# Altium schematic sheet Sheet1.SchDoc
size A3; DocumentNumber: 1; SheetNumber: 1; SheetTotal: 1
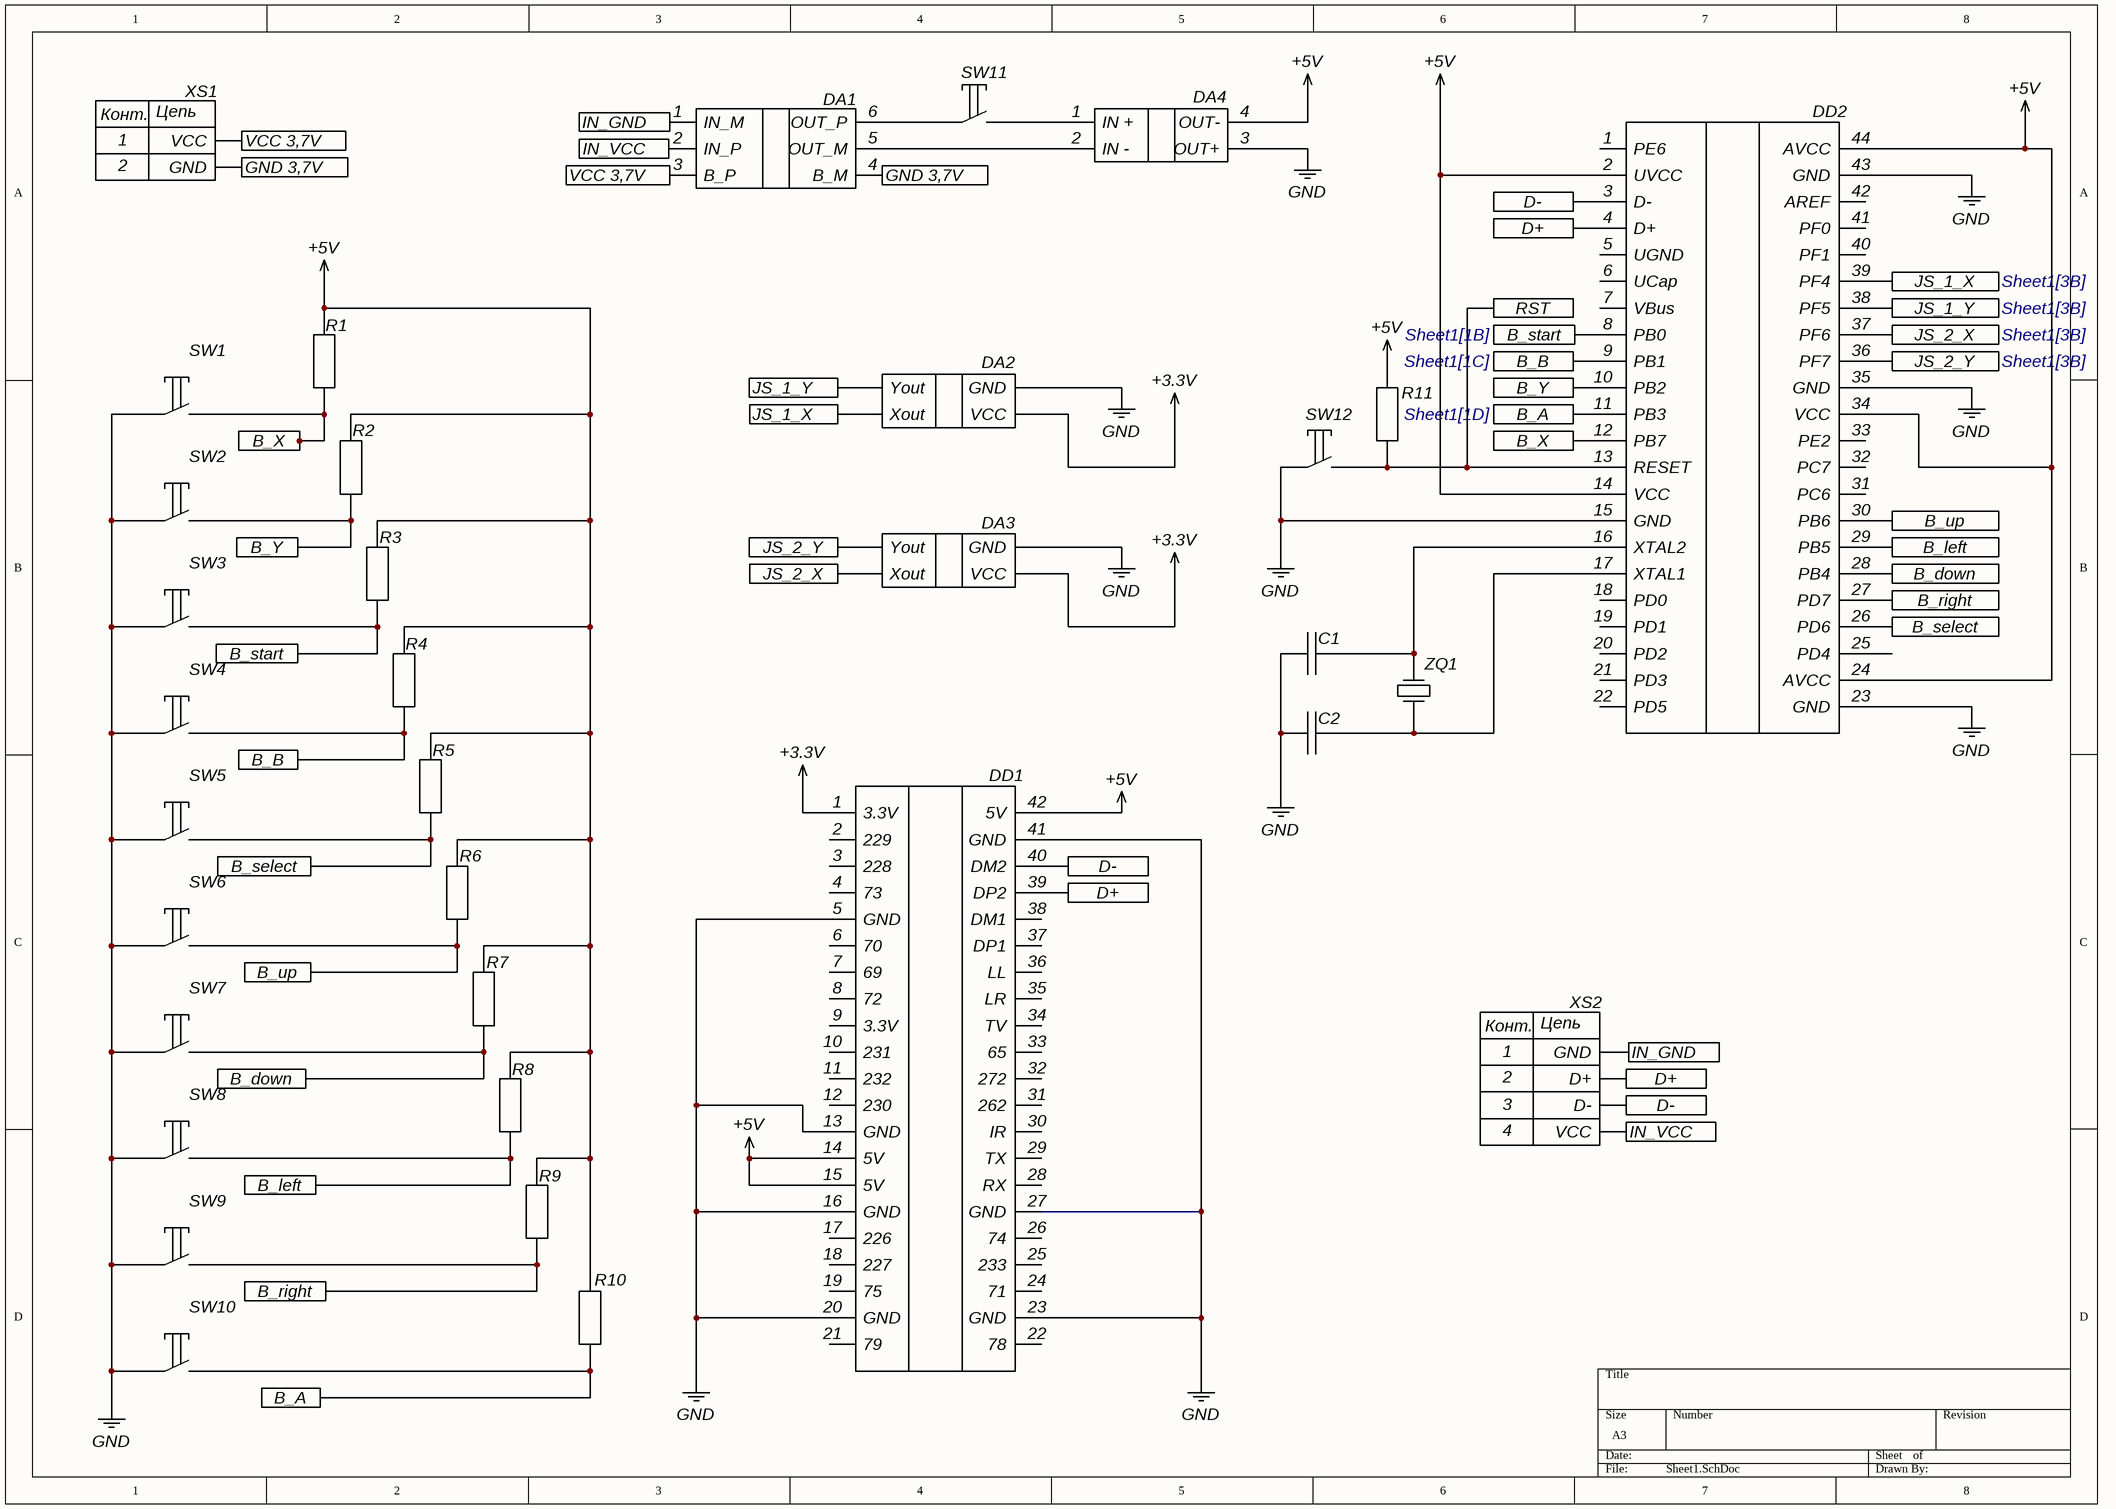
[diagram p0: Sheet1.SchDoc]

## Parts
C1  capasitor  [capacitor 1206]  (value not drawn)
C2  capasitor  [capacitor 1206]  (value not drawn)
DA1  1S 4056 BMS USB C  [1S 4056 BMS USB C]  (value not drawn)
DA2  joy stick 4 pin  [joy stick psp 4 pin]  (value not drawn)
DA3  joy stick 4 pin  [joy stick psp 4 pin]  (value not drawn)
DA4  DC-DC  [DC-DC]  (value not drawn)
DD1  orange PI ZERO 3  [orange Pi Zero 3]  (value not drawn)
DD2  ATmega32U4  [atmega32u4]  (value not drawn)
R1  resistor  [resistor 1206]  (value not drawn)
R2  resistor  [resistor 1206]  (value not drawn)
R3  resistor  [resistor 1206]  (value not drawn)
R4  resistor  [resistor 1206]  (value not drawn)
R5  resistor  [resistor 1206]  (value not drawn)
R6  resistor  [resistor 1206]  (value not drawn)
R7  resistor  [resistor 1206]  (value not drawn)
R8  resistor  [resistor 1206]  (value not drawn)
R9  resistor  [resistor 1206]  (value not drawn)
R10  resistor  [resistor 1206]  (value not drawn)
R11  resistor  [resistor 1206]  (value not drawn)
SW1  button  [switchv1]  (value not drawn)
SW2  button  [switchv1]  (value not drawn)
SW3  button  [switchv1]  (value not drawn)
SW4  button  [switchv1]  (value not drawn)
SW5  button  [switchv1]  (value not drawn)
SW6  button  [switchv1]  (value not drawn)
SW7  button  [switchv1]  (value not drawn)
SW8  button  [switchv1]  (value not drawn)
SW9  button  [switchv1]  (value not drawn)
SW10  button  [switchv1]  (value not drawn)
SW11  button  [PowerButton]  (value not drawn)
SW12  button  [membrane button]  (value not drawn)
XS1  power  [power]  (value not drawn)
XS2  TYPE-C  [TYPE-C]  (value not drawn)
ZQ1  quartz resonator  [quartz resonator 2]  (value not drawn)

## Ports
B_A (see Sheet1[1D]), B_A (see Sheet1[6B]), B_B (see Sheet1[1C]), B_B (see Sheet1[6A]), B_down (see Sheet1[1C]), B_down (see Sheet1[8B]), B_left (see Sheet1[1D]), B_left (see Sheet1[8B]), B_right (see Sheet1[1D]), B_right (see Sheet1[8B]), B_select (see Sheet1[1C]), B_select (see Sheet1[8B]), B_start (see Sheet1[1B]), B_start (see Sheet1[6A]), B_up (see Sheet1[1C]), B_up (see Sheet1[8B]), B_X (see Sheet1[1B]), B_X (see Sheet1[6B]), B_Y (see Sheet1[1B]), B_Y (see Sheet1[6B]), D+ (see Sheet1[5C], Sheet1[6A]), D+ (see Sheet1[5C], Sheet1[7C]), D+ (see Sheet1[6A], Sheet1[7C]), D- (see Sheet1[5C], Sheet1[6A]), D- (see Sheet1[5C], Sheet1[7C]), D- (see Sheet1[6A], Sheet1[7C]), GND 3,7V (see Sheet1[1A]), GND 3,7V (see Sheet1[4A]), IN_GND (see Sheet1[3A]), IN_GND (see Sheet1[7C]), IN_VCC (see Sheet1[3A]), IN_VCC (see Sheet1[7D]), JS_1_X (see Sheet1[3B]), JS_1_X (see Sheet1[8A]), JS_1_Y (see Sheet1[3B]), JS_1_Y (see Sheet1[8A]), JS_2_X (see Sheet1[3B]), JS_2_X (see Sheet1[8A]), JS_2_Y (see Sheet1[3B]), JS_2_Y (see Sheet1[8A]), RST, VCC 3,7V (see Sheet1[1A]), VCC 3,7V (see Sheet1[3A])

## Nets
+3.3V: DA2.3(VCC) DA3.3(VCC) DD1.1(3.3V)
+5V: DA4.4(OUT-) DD1.14(5V) DD1.15(5V) DD1.42(5V) DD2.2(UVCC) DD2.14(VCC) DD2.24(AVCC) DD2.34(VCC) DD2.44(AVCC) R1.2 R2.2 R3.2 R4.2 R5.2 R6.2 R7.2 R8.2 R9.2 R10.2 R11.2
GND: C1.1 C2.1 DA2.4(GND) DA3.4(GND) DA4.3(OUT+) DD1.5(GND) DD1.13(GND) DD1.16(GND) DD1.20(GND) DD1.23(GND) DD1.27(GND) DD1.41(GND) DD2.15(GND) DD2.23(GND) DD2.35(GND) DD2.43(GND) SW1.1 SW2.1 SW3.1 SW4.1 SW5.1 SW6.1 SW7.1 SW8.1 SW9.1 SW10.1 SW12.1
B_A: DD2.11(PB3) R10.1 SW10.2 ; port B_A
B_B: DD2.9(PB1) R4.1 SW4.2 ; port B_B
B_down: DD2.28(PB4) R7.1 SW7.2 ; port B_down
B_left: DD2.29(PB5) R8.1 SW8.2 ; port B_left
B_right: DD2.27(PD7) R9.1 SW9.2 ; port B_right
B_select: DD2.26(PD6) R5.1 SW5.2 ; port B_select
B_start: DD2.8(PB0) R3.1 SW3.2 ; port B_start
B_up: DD2.30(PB6) R6.1 SW6.2 ; port B_up
B_X: DD2.12(PB7) R1.1 SW1.2 ; port B_X
B_Y: DD2.10(PB2) R2.1 SW2.2 ; port B_Y
D+: DD1.39(DP2) DD2.4(D+) XS2.2(D+) ; port D+
D-: DD1.40(DM2) DD2.3(D-) XS2.3(D-) ; port D-
GND 3,7V: DA1.4(B_M) XS1.2(GND) ; port GND 3,7V
IN_GND: DA1.1(IN_M) XS2.1(GND) ; port IN_GND
IN_VCC: DA1.2(IN_P) XS2.4(VCC) ; port IN_VCC
JS_1_X: DA2.1(Xout) DD2.39(PF4) ; port JS_1_X
JS_1_Y: DA2.2(Yout) DD2.38(PF5) ; port JS_1_Y
JS_2_X: DA3.1(Xout) DD2.37(PF6) ; port JS_2_X
JS_2_Y: DA3.2(Yout) DD2.36(PF7) ; port JS_2_Y
RST: DD2.13(RESET) R11.1 SW12.2 ; port RST
VCC 3,7V: DA1.3(B_P) XS1.1(VCC) ; port VCC 3,7V
NetC1_2: C1.2 DD2.16(XTAL2) ZQ1.2
NetC2_2: C2.2 DD2.17(XTAL1) ZQ1.1
NetDA1_5: DA1.5(OUT_M) DA4.2(IN_-)
NetDA1_6: DA1.6(OUT_P) SW11.1
NetDA4_1: DA4.1(IN_+) SW11.2

Not connected (* = marked no-connect by the designer): DD1 2(229) 3(228) 4(73) 6(70) 7(69) 8(72) 9(3.3V) 10(231) 11(232) 12(230) 17(226) 18(227) 19(75) 21(79) 22(78) 24(71) 25(233) 26(74) 28(RX) 29(TX) 30(IR) 31(262) 32(272) 33(65) 34(TV) 35(LR) 36(LL) 37(DP1) 38(DM1); DD2 1(PE6) 5(UGND) 6(UCap) 7(VBus) 18(PD0) 19(PD1) 20(PD2) 21(PD3) 22(PD5) 25(PD4) 31(PC6) 32(PC7) 33(PE2) 40(PF1) 41(PF0) 42(AREF)

## Notes on the sheet
- (in symbol power) Цепь; Конт.
- (in symbol TYPE-C) Цепь; Конт.